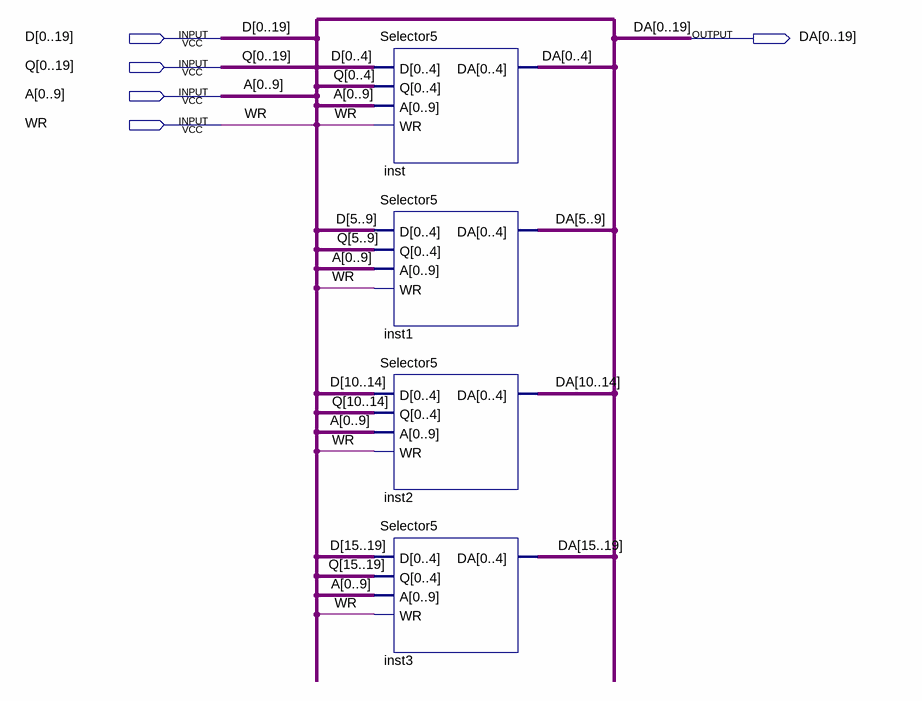
[diagram p0: schematic sheet]
// Quartus schematic Selector20.bdf as structural Verilog: 4 symbols, 5 pins
module Selector20 (
  input  [0:19] D,
  input  [0:19] Q,
  input  [0:9] A,
  input  WR,
  output [0:19] DA
);

  Selector5 inst (.D(D[0:4]), .Q(Q[0:4]), .A(A), .WR(WR), .DA(DA[0:4]));
  Selector5 inst1 (.D(D[5:9]), .Q(Q[5:9]), .A(A), .WR(WR), .DA(DA[5:9]));
  Selector5 inst2 (.D(D[10:14]), .Q(Q[10:14]), .A(A), .WR(WR), .DA(DA[10:14]));
  Selector5 inst3 (.D(D[15:19]), .Q(Q[15:19]), .A(A), .WR(WR), .DA(DA[15:19]));
endmodule
